# EAGLE design pcb (EAGLE 7.3.0)
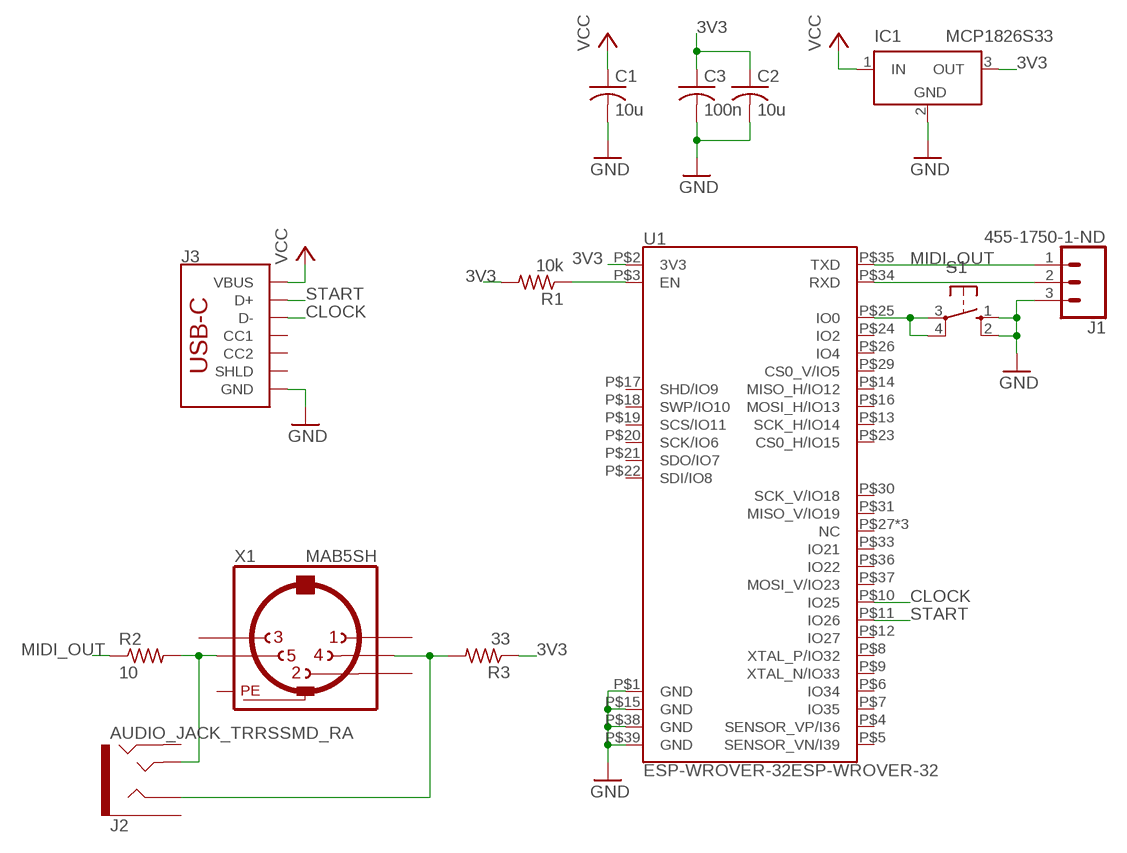
[diagram p0: schematic, sheet 1]

## Parts
C1  10u  C-USC0805  [C0805]
C2  10u  C-USC0805  [C0805]
C3  100n  C-USC0805  [C0805]
IC1  MCP1826S33  LT1129CST5  [SOT223]
J1  455-1750-1-ND  CONN_03  [1X03]
J2  AUDIO_JACK_TRRSSMD_RA  [AUDIO_JACK_3.5MM_TRRS_SMD_RA]
J3  USB_C_2-LAYER_PADS  [USB-C-16P-2LAYER-PADS]
R1  10k  R-US_R0805  [R0805]
R2  10  R-US_R0805  [R0805]
R3  33  R-US_R0805  [R0805]
S1  10-XX  [B3F-10XX]
U1  ESP-WROVER-32ESP-WROVER-32  [ESP-WROVER-32]
X1  MAB5SH  [MAB5SH]

## Nets
3V3: C2.1 C3.1 IC1.3(OUT) R1.2 R3.1 U1.P$2(3V3)
CLOCK: J3.A7(D-) J3.B7(D-) U1.P$10(IO25)
GND: C1.2 C2.2 C3.2 IC1.2(GND) J1.3 J3.GND J3.GND2(GND) S1.1(S) S1.2(S1) U1.P$1(GND) U1.P$15(GND) U1.P$38(GND) U1.P$39(GND)
MIDI_OUT: J1.1 R2.1 U1.P$35(TXD)
N$1: J2.RING1 R3.2 X1.4
N$2: R1.1 U1.P$3(EN)
N$4: J2.TIP R2.2 X1.5
N$6: J1.2 U1.P$34(RXD)
N$9: S1.3(P) S1.4(P1) U1.P$25(IO0)
START: J3.A6(D+) J3.B6(D+) U1.P$11(IO26)
VCC: C1.1 IC1.1(IN) J3.VBUS1(VBUS) J3.VBUS2(VBUS)
Unconnected: J2.EARTH J2.RING2 J3.A5(CC1) J3.B5(CC2) J3.SHLD1(SHLD) J3.SHLD2(SHLD) J3.SHLD3(SHLD) J3.SHLD4(SHLD) U1.P$4(SENSOR_VP/I36) U1.P$5(SENSOR_VN/I39) U1.P$6(IO34) U1.P$7(IO35) U1.P$8(XTAL_P/IO32) U1.P$9(XTAL_N/IO33) U1.P$12(IO27) U1.P$13(SCK_H/IO14) U1.P$14(MISO_H/IO12) U1.P$16(MOSI_H/IO13) U1.P$17(SHD/IO9) U1.P$18(SWP/IO10) U1.P$19(SCS/IO11) U1.P$20(SCK/IO6) U1.P$21(SDO/IO7) U1.P$22(SDI/IO8) U1.P$23(CS0_H/IO15) U1.P$24(IO2) U1.P$26(IO4) U1.P$27(NC) U1.P$28(NC) U1.P$29(CS0_V/IO5) U1.P$30(SCK_V/IO18) U1.P$31(MISO_V/IO19) U1.P$32(NC) U1.P$33(IO21) U1.P$36(IO22) U1.P$37(MOSI_V/IO23) X1.1 X1.2 X1.3

## Power pins joined to a net without a drawn wire
GND: IC1.4(GND)
PE: X1.PE X1.PE@(PE)

## Library data of the parts
C1-C3 = rcl:C-US: CAPACITOR, American symbol
IC1 = linear-technology:LT1129CST5: VOLTAGE REGULATOR with shutdown; MPN: LT1129CST-5#PBF; OC_FARNELL: 1663375; OC_NEWARK: 57M2069
J1 = SparkFun-Connectors:CONN_03: Multi connection point. Often used as Generic Header-pin footprint for 0.1 inch spaced/style header connections On any of the 0.1 inch spaced packages, you can populate with these: Break Away Headers - Straight <https://www.sparkfun.com/products/116> (PRT-00116) Break Away Male Headers - Right Angle <https://www.sparkfun.com/products/553> (PRT-00553) Female Headers <https://www.sparkfun.com/products/115> (PRT-00115) Break Away Headers - Machine Pin <https://www.sparkfun.com/products/117> (PRT-00117) Break Away Female Headers - Swiss Machine Pin <https://www.sparkfun.com/products/743> (PRT-00743) Stackable Header - 3 Pin (Female, 0.1") <https://www.sparkfun.com/products/13875> (PRT-13875) For SCREWTERMINALS and SPRING TERMINALS visit here: Screw Terimnals on SparkFun.com <https://www.sparkfun.com/search/results?term=Screw+Terminals> (5mm/3.5mm/2.54mm spacing) This device is also useful as a general connection point to wire up your design to another part of your project. Our various solder wires solder well into these plated through hole pads. Hook-Up Wire - Assortment (Stranded, 22 AWG) <https://www.sparkfun.com/products/11375> (PRT-11375) Hook-Up Wire - Assortment (Solid Core, 22 AWG) <https://www.sparkfun.com/products/11367> (PRT-11367) View the entire wire category on our website here <https://www.sparkfun.com/categories/141> Special notes: Molex polarized connector foot print use with SKU : PRT-08232 with associated crimp pins and housings.; PROD_ID: XXX-00000
J2 = SparkFun-Connectors:AUDIO_JACK_TRRS: Audio Jack - 3.5mm TRRS (SMD) This is a 3.5mm TRRS SMD audio jack. TRRS connectors are the audio-style connectors that you see on some phones, MP3 players and development boards. TRRS stands for “tip, ring, ring, sleeve,” which reflects that this has three conductors and a ground. SparkFun Products: Audio Jack <https://www.sparkfun.com/products/12639> mbed Starter Kit <https://www.sparkfun.com/products/12968> SparkFun TRRS 3.5mm Jack Breakout <https://www.sparkfun.com/products/11570>; PROD_ID: CONN-10676; SF_ID: PRT-12639
J3 = SparkFun-Connectors:USB_C: USB Type C 16Pin Connector Super Speed pins not available on the 16-pin purely SMD connector so this part is best for USB 2.0 implementations. D1 and D2 are tied together enabling D+/- no matter which way the cable is plugged into the connector. The two channel configuration pins (CC1/2) are exposed. These are normally connected to ground via 5.1k resistors but can be reconfigured for high current/high power applications. **4-LAYER BOARD WARNING!!** If designing 4-layer board, make sure to select the variant _4-LAYER-ISOLATED. The linked footprint (USB-C-16-4LAYER-ISOLATED) includes some very necessary cutout polygons in the inner layers (2 and 15). This prevents the PTH mounting shield legs on the USB connector from electrically connecting any other polygons on the inner layers (usually VCC and GND).; PROD_ID: CONN-14122
R1-R3 = rcl:R-US_: RESISTOR, American symbol
S1 = switch-omron:10-XX: OMRON SWITCH; MPN: B3F-1000; OC_FARNELL: 176432; OC_NEWARK: 36M3542
U1 = SparkFun-RF:ESP-WROVER-32
X1 = con-hirschmann:MAB5SH: Female CONNECTOR 5 pins 90 deg. with shield, horizontal (DIN 41524); OC_FARNELL: 809883; OC_NEWARK: unknown

## Board
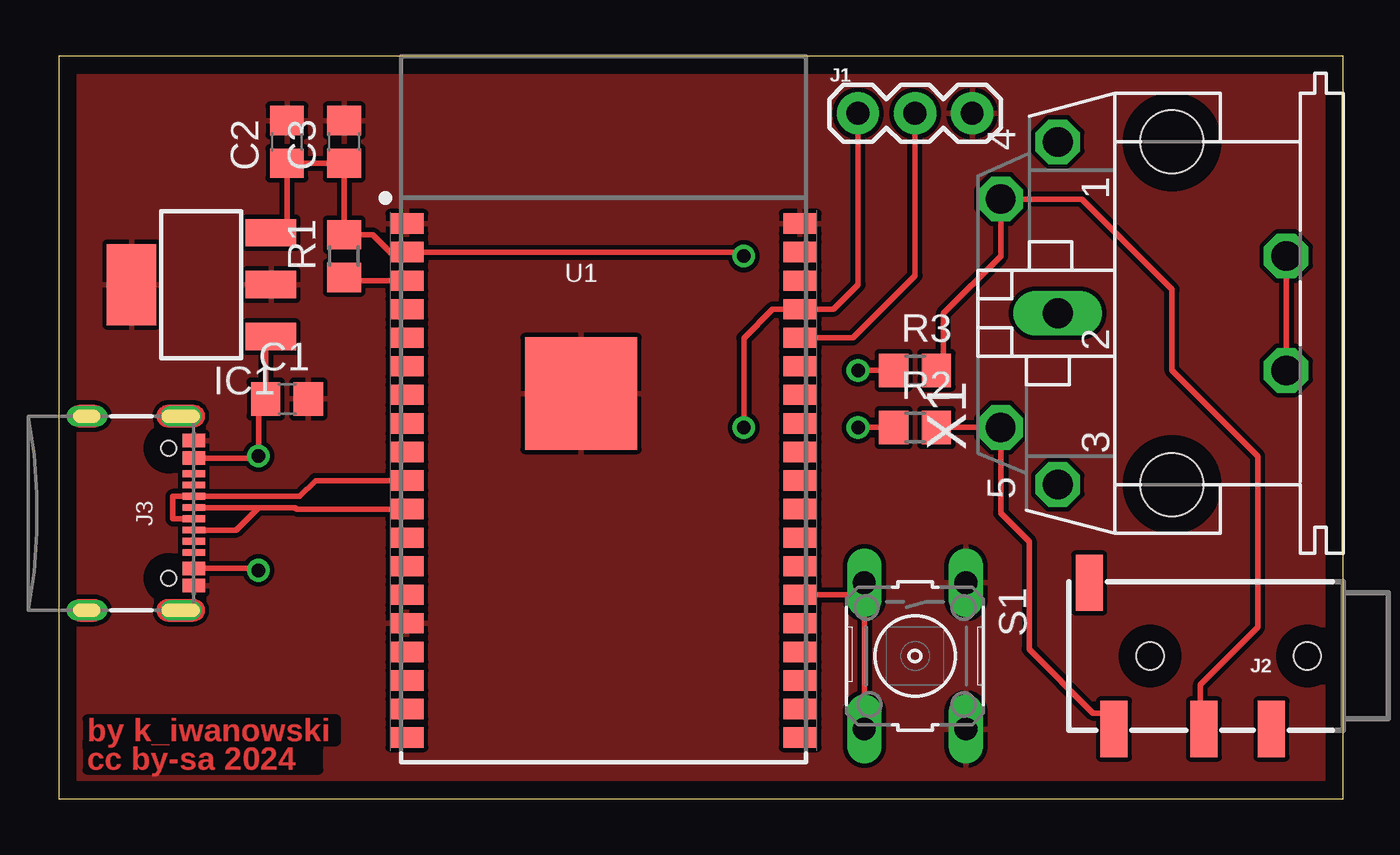
[diagram p1: board, top side]
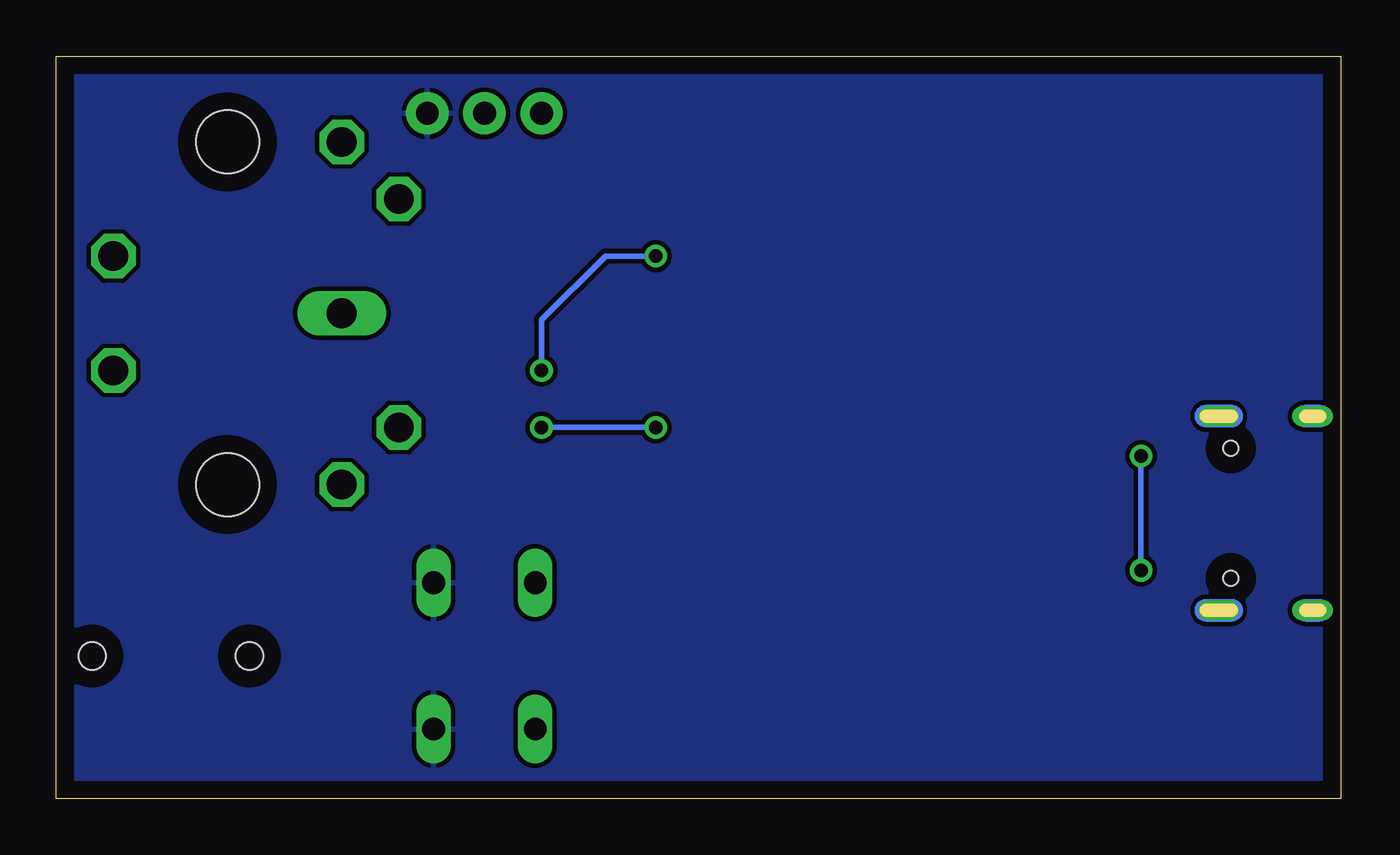
[diagram p2: board, bottom side, seen from below]

Size 57.15 x 33.02 mm. Coordinates in mm from the lower left corner, seen from the top.
Outline: 0,0 57.15,0 57.15,33.02 0,33.02 0,0
Copper layers (1*16): Top 0.035mm / dielectric 1.5mm / Bottom 0.035mm
Design rules "default *": minimum track width 9mil, minimum drill 23mil, track to track 8mil, track to pad 8mil, pad to pad 7mil, via to via 8mil, smd to smd 7mil, copper to edge 31mil, drill to drill 8mil, minimum pad ring 10mil, minimum via ring 8mil, stop-mask expansion 4mil, vias tented up to drill 0mil, thermal gap 8mil

### Footprints (pad centres in the part's own frame; a part is rotated, then mirrored left to right if it is on the bottom)
C0805 = smd 1.3 x 1.5: 1 -0.95,0; 2 0.95,0
SOT223 = smd 1.219 x 2.235: 1 -2.311,-3.099; 2 0,-3.099; 3 2.311,-3.099 | smd 3.6 x 2.2: 4 0,3.099
1X03 = drill 1.016 pad 1.88: 1 0,0; 2 2.54,0; 3 5.08,0
AUDIO_JACK_3.5MM_TRRS_SMD_RA = smd 1.2 x 2.5: EARTH 11.3,-3.25; RING1 6.2,3.25; RING2 3.2,3.25; TIP 10.2,3.25 | hole 1.2: 1.6,0; 8.6,0
USB-C-16P-2LAYER-PADS = smd 0.3 x 1: A5 -1.25,-0.34; A6 -0.25,-0.34; A7 0.25,-0.34; A8 1.25,-0.34; B5 1.75,-0.34; B6 0.75,-0.34; B7 -0.75,-0.34; B8 -1.75,-0.34 | smd 0.6 x 1: GND -3.225,-0.34; GND2 3.225,-0.34; VBUS1 -2.45,-0.34; VBUS2 2.45,-0.34 | drill 0.4 pad 0.6 long: SHLD1 -4.318,-0.915; SHLD2 4.318,-0.915; SHLD3 -4.318,-5.095; SHLD4 4.318,-5.095 | hole 0.65: -2.89,-1.445; 2.89,-1.445
R0805 = smd 1.3 x 1.5: 1 -0.95,0; 2 0.95,0
B3F-10XX = drill 1.016 long: 1 -3.251,2.261; 2 3.251,2.261; 3 -3.251,-2.261; 4 3.251,-2.261
ESP-WROVER-32 = smd 1.5 x 0.9: P$1 0.25,-7.44; P$2 0.25,-8.71; P$3 0.25,-9.98; P$4 0.25,-11.25; P$5 0.25,-12.52; P$6 0.25,-13.79; P$7 0.25,-15.06; P$8 0.25,-16.33; P$9 0.25,-17.6; P$10 0.25,-18.87; P$11 0.25,-20.14; P$12 0.25,-21.41; P$13 0.25,-22.68; P$14 0.25,-23.95; P$15 0.25,-25.22; P$16 0.25,-26.49; P$17 0.25,-27.76; P$18 0.25,-29.03; P$19 0.25,-30.3; P$20 17.75,-30.3; P$21 17.75,-29.03; P$22 17.75,-27.76; P$23 17.75,-26.49; P$24 17.75,-25.22; P$25 17.75,-23.95; P$26 17.75,-22.68; P$27 17.75,-21.41; P$28 17.75,-20.14; P$29 17.75,-18.87; P$30 17.75,-17.6; P$31 17.75,-16.33; P$32 17.75,-15.06; P$33 17.75,-13.79; P$34 17.75,-12.52; P$35 17.75,-11.25; P$36 17.75,-9.98; P$37 17.75,-8.71; P$38 17.75,-7.44 | smd 5 x 5: P$39 8,-15
MAB5SH = drill 1.321 octagon: 1 7.62,5.08; 3 -7.62,5.08; 4 5.08,7.62; 5 -5.08,7.62; PE -2.54,-5.08; PE@ 2.54,-5.08 | drill 1.321 long: 2 0,5.08 | hole 2.794: 7.62,0; -7.62,0

### Placement (x,y rotation side)
C1  10.16,17.78 0 top
C2  10.16,29.21 90 top
C3  12.7,29.21 90 top
IC1  6.35,22.86 90 top
J1  35.56,30.48 0 top
J2  57.15,6.35 180 top
J3  6.35,12.7 270 top
R1  12.7,24.13 90 top
R2  38.1,16.51 0 top
R3  38.1,19.05 0 top
S1  38.1,6.35 270 top
U1  15.24,33.02 0 top
X1  49.53,21.59 90 top

### Tracks (layer width: path | path; a pad name or v marks a point on that pad's centre or on a via)
3V3  (via drill 0.6)
  Top 0.254: v30.48,24.13 30.3,24.31 U1.P$2 15.49,24.13 14.92,24.13 13.97,25.08 R1.2 | v35.56,19.05 R3.1 | 12.7,25.43 R1.2 | C3.1 R1.2 | 12.7,27.94 C3.1 | C3.1 C2.1 10.16,25.17 IC1.3
  Bottom 0.254: v30.48,24.13 32.72,24.13 35.56,21.29 v35.56,19.05
CLOCK
  Top 0.254: U1.P$10 11.43,14.15 10.73,13.45 J3.B7 5.08,13.45 5.08,12.45 J3.A7
GND
  pour Bottom: -1.27,34.29 58.42,34.29 58.42,-1.27 -1.27,-1.27
  pour Top: -1.27,34.29 58.42,34.29 58.42,-1.27 -1.27,-1.27
MIDI_OUT  (via drill 0.6)
  Top 0.254: J1.1 35.56,22.86 34.47,21.77 U1.P$35 31.76,21.77 30.48,20.49 v30.48,16.51 | v35.56,16.51 R2.1
  Bottom 0.254: v35.56,16.51 v30.48,16.51
N$1
  Top 0.254: J2.RING1 50.8,3.1 50.8,5.08 53.34,7.62 53.34,15.24 49.53,19.05 49.53,22.65 45.51,26.67 X1.4 41.91,24.13 39.37,21.59 39.37,19.05 R3.2
N$2
  Top 0.254: U1.P$3 12.7,23.04 R1.1
N$4
  Top 0.254: R2.2 X1.5 41.91,12.7 43.18,11.43 43.18,6.65 46.02,3.81 46.95,3.81 J2.TIP
N$6
  Top 0.254: U1.P$34 35.34,20.5 38.1,23.26 J1.2
N$9
  Top 0.254: U1.P$25 35.84,9.07 | 35.84,9.07 S1.4 | S1.3 35.84,9.07
PE
  Top 0.254: X1.PE@ X1.PE
START
  Top 0.254: U1.P$11 10.59,12.88 10.52,12.95 8.89,12.95 | J3.A6 8.89,12.95 | J3.B6 7.89,11.95 8.89,12.95
VCC  (via drill 0.6)
  Top 0.254: IC1.1 9.21,20.55 C1.1 8.89,17.78 v8.89,15.24 8.89,15.15 J3.VBUS1 | J3.VBUS2 8.89,10.25 v8.89,10.16
  Bottom 0.254: v8.89,15.24 v8.89,10.16

### Text on the board
Top: by k_iwanowski | cc by-sa 2024